# Altium schematic sheet Controler.SchDoc
size A3
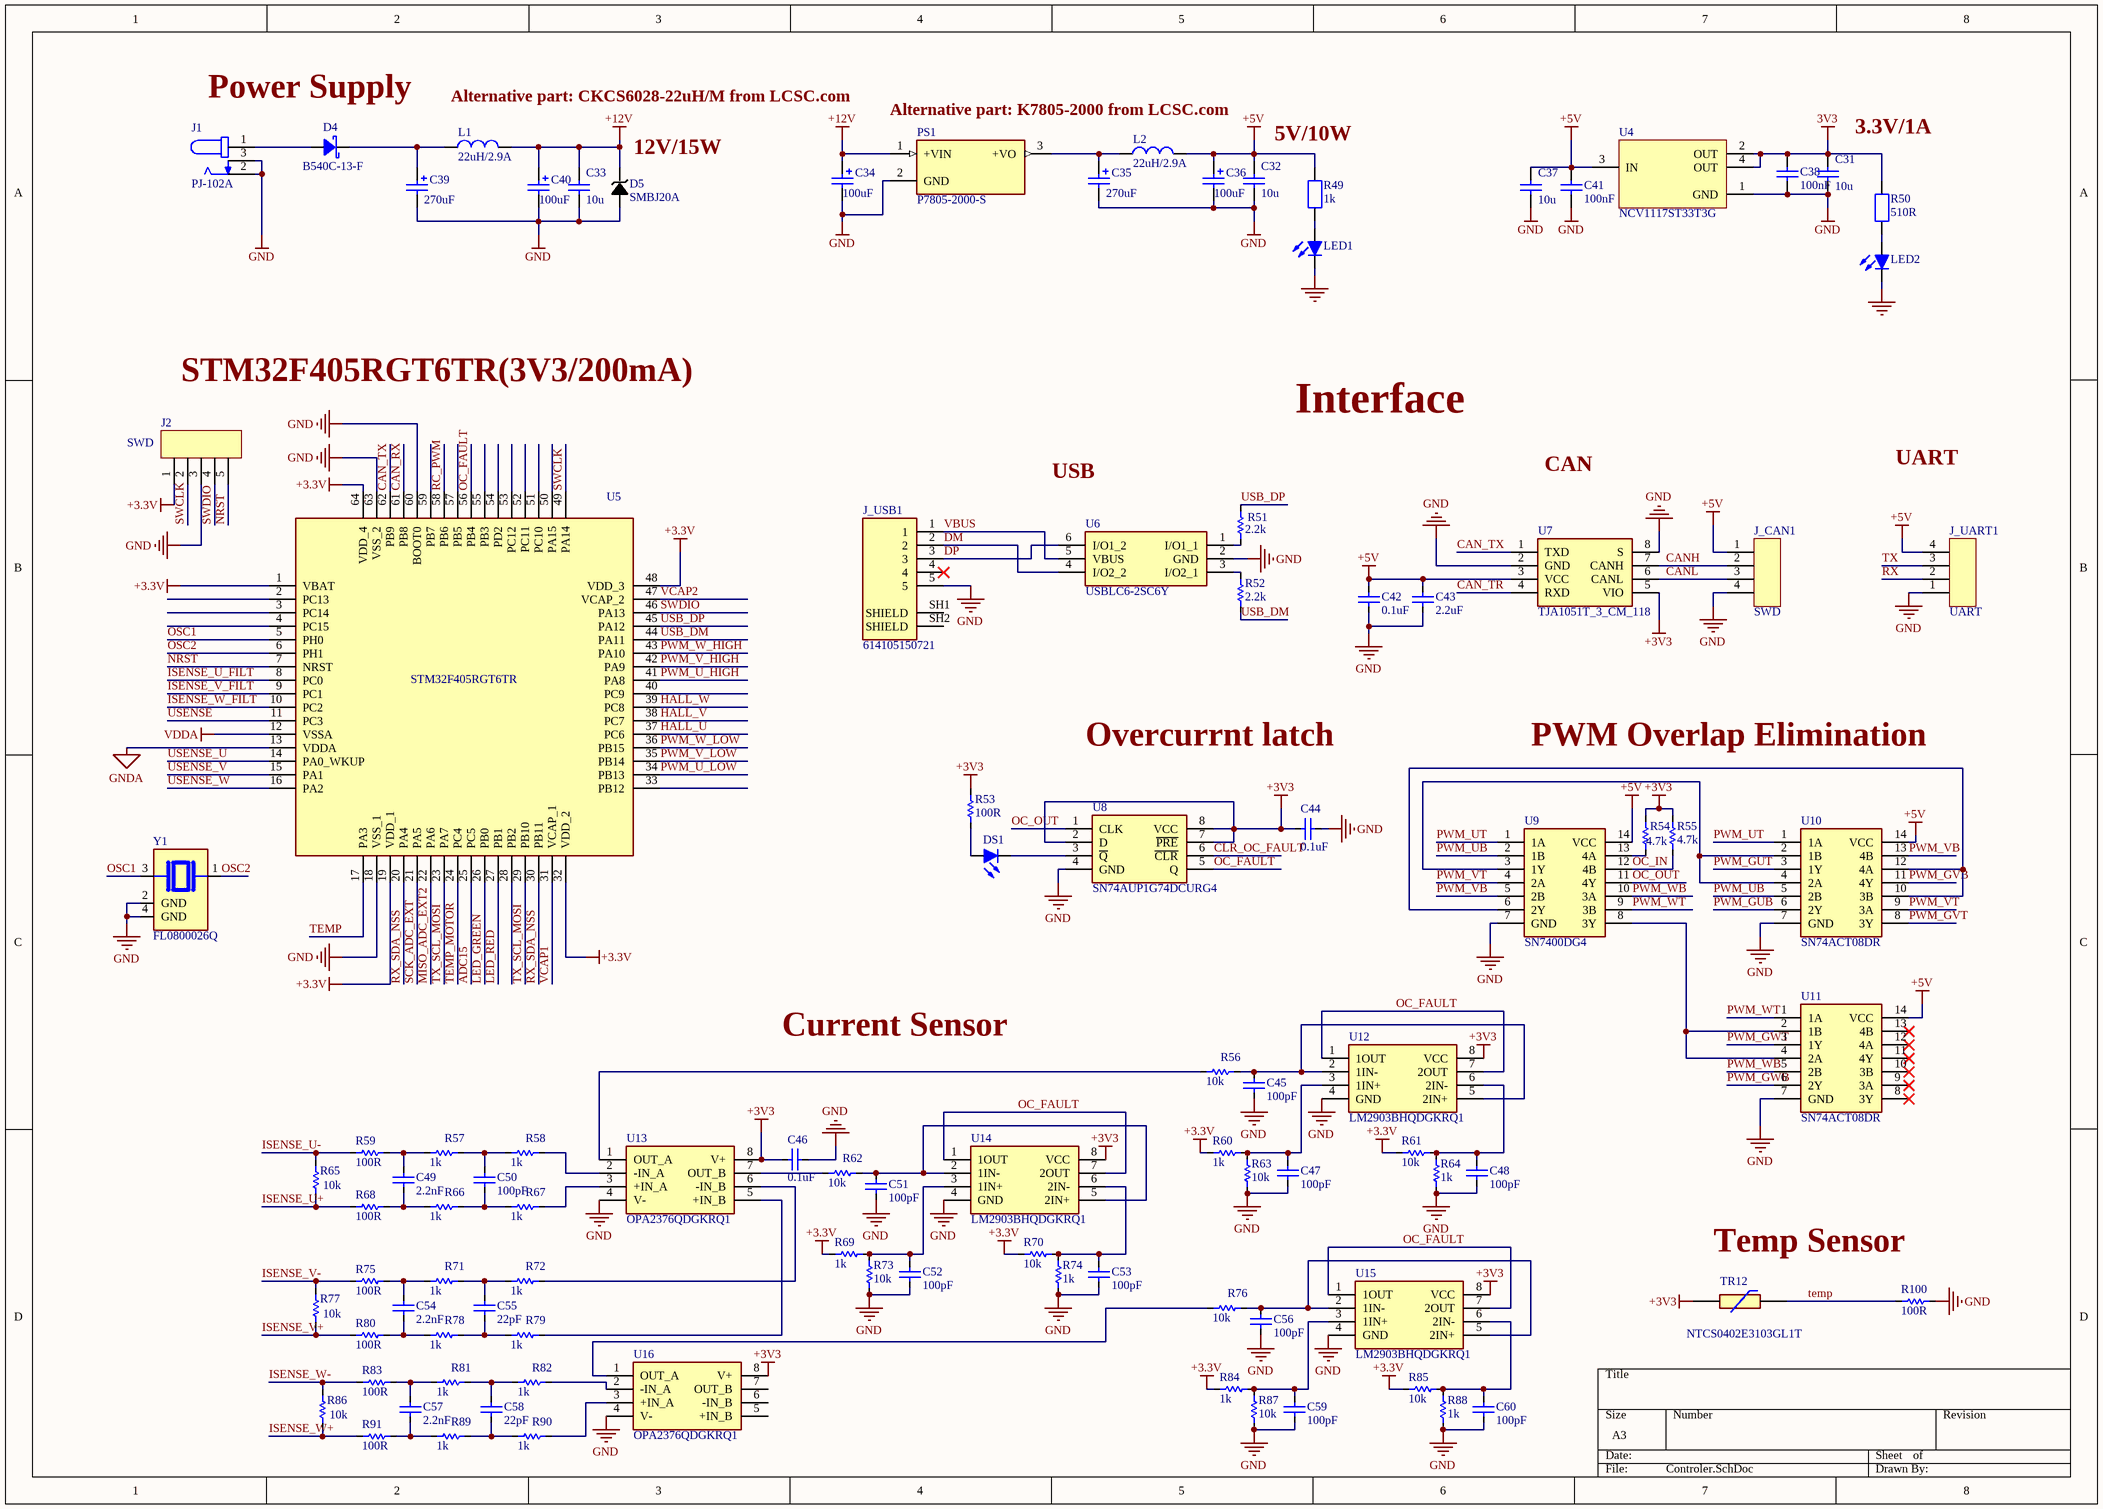
[diagram p0: Controler.SchDoc]

## Parts
C31  10u  [C1206]
C32  10u  [C1206]
C33  10u  [C1206]
C34  100uF  [CAP_EEUFC1E101S]
C35  270uF  [CAP_EEU-FK1E271B]
C36  100uF  [CAP_EEUFC1E101S]
C37  10u  [C1206]
C38  100nF  [C0603]
C39  270uF  [CAP_EEU-FK1E271B]
C40  100uF  [CAP_EEUFC1E101S]
C41  100nF  [C0603]
C42  0.1uF  [SMD_C(0402)]
C43  2.2uF  [SMD_C(0603)]
C44  0.1uF  [SMD_C(0402)]
C45  100pF  [SMD_C(0402)]
C46  0.1uF  [SMD_C(0402)]
C47  100pF  [SMD_C(0402)]
C48  100pF  [SMD_C(0402)]
C49  2.2nF  [SMD_C(0402)]
C50  100pF  [SMD_C(0402)]
C51  100pF  [SMD_C(0402)]
C52  100pF  [SMD_C(0402)]
C53  100pF  [SMD_C(0402)]
C54  2.2nF  [SMD_C(0402)]
C55  22pF  [SMD_C(0402)]
C56  100pF  [SMD_C(0402)]
C57  2.2nF  [SMD_C(0402)]
C58  22pF  [SMD_C(0402)]
C59  100pF  [SMD_C(0402)]
C60  100pF  [SMD_C(0402)]
D4  B540C-13-F  [DO-214AB2]
D5  SMBJ20A  [DO-214AA2]
DS1  SML-D12U1WT86  [LED0603]  (value not drawn)
J1  PJ-102A  [CUI_PJ-102A]
J2  SWD  [Header-2.54m-5pin]
J_CAN1  SWD  [Header-2.54m-4pin]
J_UART1  UART  [Header-2.54m-4pin]
J_USB1  614105150721  [WURTH_614105150721]
L1  22uH/2.9A  [IND_SRP6030]
L2  22uH/2.9A  [IND_SRP6030]
LED1  SML-D12U1WT86  [LED0603]  (value not drawn)
LED2  SML-D12U1WT86  [LED0603]  (value not drawn)
PS1  P7805-2000-S  [CONV_P7805-2000-S]
R49  1k  [R0603]
R50  510R  [R0603]
R51  2.2k  [SMD_R(0402)]
R52  2.2k  [SMD_R(0402)]
R53  100R  [SMD_R(0402)]
R54  4.7k  [SMD_R(0402)]
R55  4.7k  [SMD_R(0402)]
R56  10k  [SMD_R(0402)]
R57  1k  [SMD_R(0402)]
R58  1k  [SMD_R(0402)]
R59  100R  [SMD_R(0402)]
R60  1k  [SMD_R(0402)]
R61  10k  [SMD_R(0402)]
R62  10k  [SMD_R(0402)]
R63  10k  [SMD_R(0402)]
R64  1k  [SMD_R(0402)]
R65  10k  [SMD_R(0402)]
R66  1k  [SMD_R(0402)]
R67  1k  [SMD_R(0402)]
R68  100R  [SMD_R(0402)]
R69  1k  [SMD_R(0402)]
R70  10k  [SMD_R(0402)]
R71  1k  [SMD_R(0402)]
R72  1k  [SMD_R(0402)]
R73  10k  [SMD_R(0402)]
R74  1k  [SMD_R(0402)]
R75  100R  [SMD_R(0402)]
R76  10k  [SMD_R(0402)]
R77  10k  [SMD_R(0402)]
R78  1k  [SMD_R(0402)]
R79  1k  [SMD_R(0402)]
R80  100R  [SMD_R(0402)]
R81  1k  [SMD_R(0402)]
R82  1k  [SMD_R(0402)]
R83  100R  [SMD_R(0402)]
R84  1k  [SMD_R(0402)]
R85  10k  [SMD_R(0402)]
R86  10k  [SMD_R(0402)]
R87  10k  [SMD_R(0402)]
R88  1k  [SMD_R(0402)]
R89  1k  [SMD_R(0402)]
R90  1k  [SMD_R(0402)]
R91  100R  [SMD_R(0402)]
R100  100R  [SMD_R(0402)]
TR12  NTCS0402E3103GL1T  [THRMC1005X65N]
U4  NCV1117ST33T3G  [SOT223-3]
U5  STM32F405RGT6TR  [QFP50P1200X1200X160-64N]
U6  USBLC6-2SC6Y  [SOT95P280X145-6N]
U7  TJA1051T_3_CM_118  [SOIC127P600X175-8N]
U8  SN74AUP1G74DCURG4  [SOP50P310X90-8N]
U9  SN7400DG4  [SOIC127P600X175-14N]
U10  SN74ACT08DR  [SOIC127P600X175-14N]
U11  SN74ACT08DR  [SOIC127P600X175-14N]
U12  LM2903BHQDGKRQ1  [SOP65P490X110-8N]
U13  OPA2376QDGKRQ1  [SOP65P490X110-8N]
U14  LM2903BHQDGKRQ1  [SOP65P490X110-8N]
U15  LM2903BHQDGKRQ1  [SOP65P490X110-8N]
U16  OPA2376QDGKRQ1  [SOP65P490X110-8N]
Y1  FL0800026Q  [XTAL_FL0800026Q]

## Nets
3V3: C31.2 C38.2 R50.2 U4.2(OUT) U4.4(OUT)
+3.3V: J2.1 R60.1 R61.1 R69.1 R70.1 R84.1 R85.1 U5.1(VBAT) U5.19(VDD_1) U5.32(VDD_2) U5.48(VDD_3) U5.64(VDD_4)
+3V3: C44.2 C46.1 R53.2 R54.2 R55.2 TR12.2 U7.5(VIO) U8.2(D) U8.7(~{PRE}) U8.8(VCC) U12.8(VCC) U13.8(V+) U14.8(VCC) U15.8(VCC) U16.8(V+)
+5V: C32.2 C36.1 C37.2 C41.2 C42.2 C43.2 J_CAN1.1 J_UART1.4 L2.2 R49.2 U4.3(IN) U7.3(VCC) U9.14(VCC) U10.14(VCC) U11.14(VCC)
+12V: C33.2 C34.1 C40.1 D5.C L1.2 PS1.1(+VIN)
GND: C31.1 C32.1 C33.1 C34.2 C35.2 C36.2 C37.1 C38.1 C39.2 C40.2 C41.1 C42.1 C43.1 C44.1 C45.1 C46.2 C47.1 C48.1 C51.1 C52.1 C53.1 C56.1 C59.1 C60.1 D5.A J1.2 J1.3 J2.3 J_CAN1.4 J_UART1.1 J_USB1.5 LED1.C LED2.C PS1.2(GND) R63.2 R64.2 R73.2 R74.2 R87.2 R88.2 R100.1 U4.1(GND) U5.18(VSS_1) U5.60(BOOT0) U5.63(VSS_2) U6.2(GND) U7.2(GND) U7.8(S) U8.4(GND) U9.7(GND) U10.7(GND) U11.7(GND) U12.4(GND) U13.4(V-) U14.4(GND) U15.4(GND) U16.4(V-) Y1.2(GND) Y1.4(GND)
GNDA: U5.13(VDDA)
VDDA: U5.12(VSSA)
ADC15: U5.25(PC5)
CAN_RX: U5.61(PB8)
CAN_TR: U7.4(RXD)
CAN_TX: U5.62(PB9) U7.1(TXD)
CANH: J_CAN1.2 U7.7(CANH)
CANL: J_CAN1.3 U7.6(CANL)
CLR_OC_FAULT: U8.6(~{CLR})
DM: J_USB1.2 U6.4(I/O2_2)
DP: J_USB1.3 U6.6(I/O1_2)
HALL_U: U5.37(PC6)
HALL_V: U5.38(PC7)
HALL_W: U5.39(PC8)
ISENSE_U+: R65.2 R68.2
ISENSE_U-: R59.2 R65.1
ISENSE_U_FILT: U5.8(PC0)
ISENSE_V+: R77.2 R80.2
ISENSE_V-: R75.2 R77.1
ISENSE_V_FILT: U5.9(PC1)
ISENSE_W+: R86.2 R91.2
ISENSE_W-: R83.2 R86.1
ISENSE_W_FILT: U5.10(PC2)
LED_GREEN: U5.26(PB0)
LED_RED: U5.27(PB1)
MISO_ADC_EXT2: U5.22(PA6)
NRST: J2.5 U5.7(NRST)
OC_FAULT: U5.56(PB4) U8.5(Q) U12.1(1OUT) U12.7(2OUT) U14.1(1OUT) U14.7(2OUT) U15.1(1OUT) U15.7(2OUT)
OC_IN: R55.1 U9.12(4B)
OC_OUT: U8.1(CLK) U9.11(4Y)
OSC1: U5.5(PH0) Y1.3
OSC2: U5.6(PH1) Y1.1
PWM_GUB: U10.6(2Y)
PWM_GUT: U10.3(1Y)
PWM_GVB: U10.11(4Y)
PWM_GVT: U10.8(3Y)
PWM_GWB: U11.6(2Y)
PWM_GWT: U11.3(1Y)
PWM_U_HIGH: U5.41(PA8)
PWM_U_LOW: U5.34(PB13)
PWM_UB: U9.2(1B) U10.5(2B)
PWM_UT: U9.1(1A) U10.1(1A)
PWM_V_HIGH: U5.42(PA9)
PWM_V_LOW: U5.35(PB14)
PWM_VB: U9.5(2B) U10.13(4B)
PWM_VT: U9.4(2A) U10.9(3A)
PWM_W_HIGH: U5.43(PA10)
PWM_W_LOW: U5.36(PB15)
PWM_WB: U9.10(3A) U11.5(2B)
PWM_WT: U9.9(3B) U11.1(1A)
RC_PWM: U5.58(PB6)
RX: J_UART1.2
RX_SDA_NSS: U5.20(PA4) U5.30(PB11)
SCK_ADC_EXT: U5.21(PA5)
SWCLK: J2.2 U5.49(PA14)
SWDIO: J2.4 U5.46(PA13)
TEMP: R100.2 TR12.1 U5.17(PA3)
TEMP_MOTOR: U5.24(PC4)
TX: J_UART1.3
TX_SCL_MOSI: U5.23(PA7) U5.29(PB10)
USB_DM: R52.2 U5.44(PA11)
USB_DP: R51.2 U5.45(PA12)
USENSE: U5.11(PC3)
USENSE_U: U5.14(PA0_WKUP)
USENSE_V: U5.15(PA1)
USENSE_W: U5.16(PA2)
VBUS: J_USB1.1 U6.5(VBUS)
VCAP1: U5.31(VCAP_1)
VCAP2: U5.47(VCAP_2)
NetC35_1: C35.1 L2.1 PS1.3(+VO)
NetC39_1: C39.1 D4.C L1.1
NetC45_2: C45.2 R56.1 U12.2(1IN-) U12.5(2IN+)
NetC47_2: C47.2 R60.2 R63.1 U12.3(1IN+)
NetC48_2: C48.2 R61.2 R64.1 U12.6(2IN-)
NetC49_1: C49.1 R66.2 R68.1
NetC49_2: C49.2 R57.2 R59.1
NetC50_1: C50.1 R66.1 R67.2
NetC50_2: C50.2 R57.1 R58.2
NetC51_2: C51.2 R62.1 U14.2(1IN-) U14.5(2IN+)
NetC52_2: C52.2 R69.2 R73.1 U14.3(1IN+)
NetC53_2: C53.2 R70.2 R74.1 U14.6(2IN-)
NetC54_1: C54.1 R78.2 R80.1
NetC54_2: C54.2 R71.2 R75.1
NetC55_1: C55.1 R78.1 R79.2
NetC55_2: C55.2 R71.1 R72.2
NetC56_2: C56.2 R76.1 U15.2(1IN-) U15.5(2IN+)
NetC57_1: C57.1 R89.2 R91.1
NetC57_2: C57.2 R81.2 R83.1
NetC58_1: C58.1 R89.1 R90.2
NetC58_2: C58.2 R81.1 R82.2
NetC59_2: C59.2 R84.2 R87.1 U15.3(1IN+)
NetC60_2: C60.2 R85.2 R88.1 U15.6(2IN-)
NetD4_A: D4.A J1.1
NetDS1_A: DS1.A R53.1
NetDS1_C: DS1.C U8.3(~{Q})
NetLED1_A: LED1.A R49.1
NetLED2_A: LED2.A R50.1
NetR51_1: R51.1 U6.1(I/O1_1)
NetR52_1: R52.1 U6.3(I/O2_1)
NetR54_1: R54.1 U9.13(4A)
NetR56_2: R56.2 U13.1(OUT_A)
NetR58_1: R58.1 U13.2(-IN_A)
NetR62_2: R62.2 U13.7(OUT_B)
NetR67_1: R67.1 U13.3(+IN_A)
NetR72_1: R72.1 U13.6(-IN_B)
NetR76_2: R76.2 U16.1(OUT_A)
NetR79_1: R79.1 U13.5(+IN_B)
NetR82_1: R82.1 U16.2(-IN_A)
NetR90_1: R90.1 U16.3(+IN_A)
NetU9_3: U9.3(1Y) U10.2(1B) U10.4(2A)
NetU9_6: U9.6(2Y) U10.10(3B) U10.12(4A)
NetU9_8: U9.8(3Y) U11.2(1B) U11.4(2A)

Not connected (* = marked no-connect by the designer): J_USB1 4* SH1(SHIELD) SH2(SHIELD); U5 2(PC13) 3(PC14) 4(PC15) 28(PB2) 33(PB12) 40(PC9) 50(PA15) 51(PC10) 52(PC11) 53(PC12) 54(PD2) 55(PB3) 57(PB5) 59(PB7); U11 8(3Y)* 9(3A)* 10(3B)* 11(4Y)* 12(4A)* 13(4B)*; U16 5(+IN_B) 6(-IN_B) 7(OUT_B)

## Notes on the sheet
- Power Supply
- (near L1) Alternative part: CKCS6028-22uH/M from LCSC.com
- (near D5) 12V/15W
- Alternative part: K7805-2000 from LCSC.com
- 5V/10W
- 3.3V/1A
- STM32F405RGT6TR(3V3/200mA)
- Interface
- USB
- CAN
- UART
- Overcurrnt latch
- PWM Overlap Elimination
- Current Sensor
- Temp Sensor

## Library data of the parts
C31-C33 C37 = 10uF ± 10% 25V: Manufacturer: Yageo; Manufacturer Part Number: CC1206KKX7R8BB106; Tolerance: +-10%; Type: X7R; Voltage (V): 25; Category: Capacitor; Value: 10u; Price: 0.44; Supplier: Mouser; Supplier Part Number: 603-CC126KKX7R8BB106
C34 C36 C40 = EEU-FC1E101S: CAP ALUM 100UF 20% 25V SMD; Manufacturer: Panasonic; Manufacturer Part Number: EEU-FC1E101S; Value: 100uF; Supplier: Mouser; Supplier Part Number: 667-EEU-FC1E101S; Price: 0.4
C35 C39 = EEU-FC1E271B: CAP ALUM 270UF 20% 25V SMD; Manufacturer: Panasonic; Manufacturer Part Number: EEU-FC1E271B; Value: 270uF; Supplier: Mouser; Supplier Part Number: 667-EEU-FC1E271B; Price: 0.7
C38 C41 = 100nF ± 10% 50V: Manufacturer: Yageo; Manufacturer Part Number: CC0603KRX7R9BB104; Value: 100nF; Supplier: Mouser; Supplier Part Number: 603-CC603KRX7R9BB104; Price: 0.1
C42 C44 C46 = Cap_1: Multilayer Ceramic Capacitors MLCC - SMD/SMT 50 V 0.1uF X7R 0603 10%; Manufacturer: Yageo; Manufacturer Part Number: CC0603KPX7R9BB104; Supplier 1: Digi-Key; Supplier Part Number 1: 311-3567-1-ND
C43 = Cap_4: Multilayer Ceramic Capacitors MLCC - SMD/SMT 2.2 uF 50 VDC 10% 1206 X7R AEC-Q200; Manufacturer: Yageo; Manufacturer Part Number: GCM31CR71H225KA55K; Supplier 1: Digi-Key; Supplier Part Number 1: 311-3567-1-ND
C45 C47-C60 = Cap_7: PHE840MA6100MA04R17; Manufacturer: Yageo; Manufacturer Part Number: CC0603KPX7R9BB104; Supplier 1: Digi-Key; Supplier Part Number 1: 311-3567-1-ND
D4 = B540C-13-F: Schottky Diodes & Rectifiers 40V 5A; Value: B540C-13-F; Manufacturer Part Number: B540C-13-F; Manufacturer: Diodes; Supplier: Mouser; Supplier Part Number: 621-B540C-F; Price: 0.5
D5 = ZM4746A-GS08: ESD Suppressors / TVS Diodes 600W, 23.4V, 5%, Unidirectional, TVS; Manufacturer: Littelfuse; Value: SMBJ20A; Manufacturer Part Number: SMBJ20A; Supplier: Mouser; Supplier Part Number: 576-SMBJ20A; Price: 0.35
DS1 LED1 LED2 = SML-D12U1WT86: Typical RED GaAs LED; Manufacturer: Rohm Semiconductor; Supplier: Mouser; Supplier Part Number: 755-SML-D12U1WT86; Manufacturer Part Number: SML-D12U1WT86; Value: SML-D12U1WT86; Price: 0.2
J1 = PJ-102A: CONN PWR JACK 2X5.5MM SOLDER; Manufacturer: CUI Devices; Manufacturer Part Number: PJ-102A; Value: PJ-102A; Supplier: Mouser; Supplier Part Number: 490-PJ-102A; Price: 0.8
J2 = 5PinConnector
J_CAN1 J_UART1 = 4PinConnector
J_USB1 = 614105150721: USB - micro B USB 2.0 Receptacle Connector 5 Position Through Hole; MF: Wurth Electronics; Package: None; Digi-Key_Part_Number: 732-5958-1-ND; MP: 614105150721; SnapEDA_Link: https://www.snapeda.com/parts/614105150721/Wurth%20Electronics%20Inc./view-part/1118291/?ref=snap; Value: *; Digi-Key_Purchase_URL: https://www.digikey.com/product-detail/en/w-rth-elektronik/614105150721/732-5958-1-ND/5047553?utm_source=snapeda&utm_medium=aggregator&utm_campaign=symbol
L1 L2 = SRP6030WA-220M: Power Inductors - SMD Ind,7.1x6.6x2.8mm,22uH+/-20%,2.9A,shd; Manufacturer: Bourns; Manufacturer Part Number: SRP6030WA-220M; Value: 22uH/2.9A; Supplier: Mouser; Supplier Part Number: 652-SRP6030WA-220M; Price: 1.2
PS1 = P7805-2000-S: 2 A Output Current, 6~36 Vdc Input, SIP, Non-Isolated, Dc-Dc Converter; Manufacturer: CUI Inc.; Price: 6.5; Supplier: Mouser; Value: P7805-2000-S; Supplier Part Number: 490-P7805-2000-S; Manufacturer Part Number: P7805-2000-S
R49 = 1 kOhms ±1% 0.1W: Manufacturer: Yageo; Manufacturer Part Number: RC0603FR-071KL; Value: 1k; Supplier: Mouser; Supplier Part Number: 603-RC0603FR-071KL; Price: 0.1
R50 = 510 Ohm ±1% 0.1W: Manufacturer: Yageo; Manufacturer Part Number: RC0603FR-07510RL; Value: 510R; Supplier: Mouser; Supplier Part Number: 603-RC0603FR-07510RL; Price: 0.1
R51 R52 = Res Semi_2: CRCW04024R02FKED; Published: 8-Jun-2000; LatestRevisionDate: 17-Jul-2002; LatestRevisionNote: Re-released for DXP Platform.; PackageReference: AXIAL-0.5; Publisher: Altium Limited; PackageDescription: Axial Device, Thru-Hole; 2 Leads; 0.5 in Pin Spacing
R53 R56-R91 R100 = Res Semi_1: CRCW04024R02FKED; Published: 8-Jun-2000; LatestRevisionDate: 17-Jul-2002; LatestRevisionNote: Re-released for DXP Platform.; PackageReference: AXIAL-0.5; Publisher: Altium Limited; PackageDescription: Axial Device, Thru-Hole; 2 Leads; 0.5 in Pin Spacing
R54 R55 = Res Semi_3: CRCW04024R02FKED; Published: 8-Jun-2000; LatestRevisionDate: 17-Jul-2002; LatestRevisionNote: Re-released for DXP Platform.; PackageReference: AXIAL-0.5; Publisher: Altium Limited; PackageDescription: Axial Device, Thru-Hole; 2 Leads; 0.5 in Pin Spacing
TR12 = NTCS0402E3103GL1T: NTC Thermistors 10Kohms 2% AEC-Q200; Manufacturer_Name: Vishay; Geometry.Height: 0.65mm; Mouser Part Number: 594-NTCS402E3103GL1T; Mouser Price/Stock: https://www.mouser.co.uk/ProductDetail/Vishay-BC-Components/NTCS0402E3103GL1T?qs=u16ybLDytRYI8lwq3wWutw%3D%3D; Manufacturer_Part_Number: NTCS0402E3103GL1T; Datasheet Link: https://www.mouser.in/datasheet/2/427/ntcs0402e3t-1762119.pdf
U4 = NCV1117ST33T3G: LDO Voltage Regulators 3.3V 1.0A Automotive; Manufacturer: onsemi; Price: 0.7; Manufacturer Part Number: NCV1117ST33T3G; Supplier Part Number: 863-NCV1117ST33T3G; Value: NCV1117ST33T3G; Supplier: Mouser
U5 = STM32F405RGT6TR: STM32F405RGT6TR, 32 bit ARM Cortex M4 MCU 168MHz 1024 kB Flash, 192 kB RAM, 2xUSB CAN I2C 64-Pin LQFP; Manufacturer_Name: STMicroelectronics; Geometry.Height: 1.6mm; Mouser Part Number: 511-STM32F405RGT6TR; Mouser Price/Stock: https://www.mouser.co.uk/ProductDetail/STMicroelectronics/STM32F405RGT6TR?qs=MavH1QghrkHshpR6GkvPIg%3D%3D; Manufacturer_Part_Number: STM32F405RGT6TR; Datasheet Link: http://www.st.com/web/en/resource/technical/document/datasheet/DM00037051.pdf
U6 = USBLC6-2SC6Y: Low Cap. ESD Protection Auto SOT-23-6 STMicroelectronics USBLC6-2SC6Y, Dual Uni-Directional TVS Diode Array, 6-Pin SOT-23; Geometry.Height: 1.45mm; Mouser Part Number: 511-USBLC6-2SC6Y; Mouser Price/Stock: https://www.mouser.co.uk/ProductDetail/STMicroelectronics/USBLC6-2SC6Y?qs=gNDSiZmRJS%2FOgDexvXkdow%3D%3D; Manufacturer_Name: STMicroelectronics; Manufacturer_Part_Number: USBLC6-2SC6Y; Datasheet Link: https://componentsearchengine.com/Datasheets/1/USBLC6-2SC6Y.pdf
U7 = TJA1051T_3_CM_118: CAN Interface IC BL Advanced Automotive Analog; Manufacturer_Name: NXP; Manufacturer_Part_Number: TJA1051T/3/CM,118; Geometry.Height: 1.75mm; Mouser Part Number: 771-TJA1051T/3CM118; Mouser Price/Stock: https://www.mouser.co.uk/ProductDetail/NXP-Semiconductors/TJA1051T-3-CM118?qs=5XOdhvmYM0NUkmo%252BpXvJfw%3D%3D; Datasheet Link: http://www.nxp.com/docs/en/data-sheet/TJA1051.pdf
U8 = SN74AUP1G74DCURG4: Flip Flops Lo PWR SNGL Pos Edge Trgrd DType FlipFlop; Manufacturer_Name: Texas Instruments; Geometry.Height: 0.9mm; Mouser Part Number: 595-74AUP1G74DCURG4; Mouser Price/Stock: https://www.mouser.co.uk/ProductDetail/Texas-Instruments/SN74AUP1G74DCURG4?qs=7kv20MEVUlhYDCdFtbMd%2FA%3D%3D; Manufacturer_Part_Number: SN74AUP1G74DCURG4; Datasheet Link: *
U9 = SN7400DG4: NAND Gate 4-Element 2-IN Bipolar 14-Pin SOIC Tube; Manufacturer_Name: Texas Instruments; Geometry.Height: 1.75mm; Mouser Part Number: 595-SN7400DG4; Mouser Price/Stock: https://www.mouser.co.uk/ProductDetail/Texas-Instruments/SN7400DG4?qs=E8lYj0tdJGGtKkNRXTqCCA%3D%3D; Manufacturer_Part_Number: SN7400DG4; Datasheet Link: https://www.arrow.com/en/products/sn7400dg4/texas-instruments
U10 U11 = SN74ACT08DR: Texas Instruments SN74ACT08DR, AND Quad 2 Input AND, 4.5  5.5 V, 14-Pin SOIC; Geometry.Height: 1.75mm; Mouser Part Number: 595-SN74ACT08DR; Mouser Price/Stock: https://www.mouser.co.uk/ProductDetail/Texas-Instruments/SN74ACT08DR?qs=AMJt07B76uu%2FkRdXJtIwhw%3D%3D; Manufacturer_Name: Texas Instruments; Manufacturer_Part_Number: SN74ACT08DR; Datasheet Link: http://www.ti.com/lit/gpn/sn74act08
U12 U14 U15 = LM2903BHQDGKRQ1: Analog Comparators Automotive, dual, differential, commodity comparator; Manufacturer_Name: Texas Instruments; Geometry.Height: 1.1mm; Mouser Part Number: 595-LM2903BHQDGKRQ1; Mouser Price/Stock: https://www.mouser.co.uk/ProductDetail/Texas-Instruments/LM2903BHQDGKRQ1?qs=By6Nw2ByBD2mW87GUmotXw%3D%3D; Manufacturer_Part_Number: LM2903BHQDGKRQ1; Datasheet Link: https://www.ti.com/lit/ds/symlink/lm2903b-q1.pdf?HQS=dis-mous-null-mousermode-dsf-pf-null-wwe&ts=1670767488652&ref_url=https%253A%252F%252Fwww.mouser.de%252F
U13 U16 = OPA2376QDGKRQ1: Low Noise, Low Quiescent Current, Precision Operational Amplifier e-trim/trade; Manufacturer_Name: Texas Instruments; Geometry.Height: 1.1mm; Mouser Part Number: 595-OPA2376QDGKRQ1; Mouser Price/Stock: https://www.mouser.co.uk/ProductDetail/Texas-Instruments/OPA2376QDGKRQ1?qs=zEmsApcVOkU338m46%2F1O7A%3D%3D; Manufacturer_Part_Number: OPA2376QDGKRQ1; Datasheet Link: http://www.ti.com/lit/gpn/opa2376-q1
Y1 = FL0800026Q: 8 MHz Â±30ppm Crystal 8pF 400 Ohms 4-SMD, No Lead; MF: Diodes Incorporated; Package: NON STANDARD-4 Diodes Inc.; Price: None; Check_prices: https://www.snapeda.com/parts/FL0800026Q/Diodes+Inc./view-part/?ref=eda; Value: *; SnapEDA_Link: https://www.snapeda.com/parts/FL0800026Q/Diodes+Inc./view-part/?ref=snap; MP: FL0800026Q; Availability: In Stock; Purchase-URL: https://pricing.snapeda.com/search?q=FL0800026Q&ref=eda